# EasyEDA schematic SCH_Sensor-Wind_EasyEDA.json
TITLE: Wind Sensor; REV: 1.0; Date: 2021-08-31; Sheet: 1/1; Drawn By: mromanini; Company: Scott and Marco
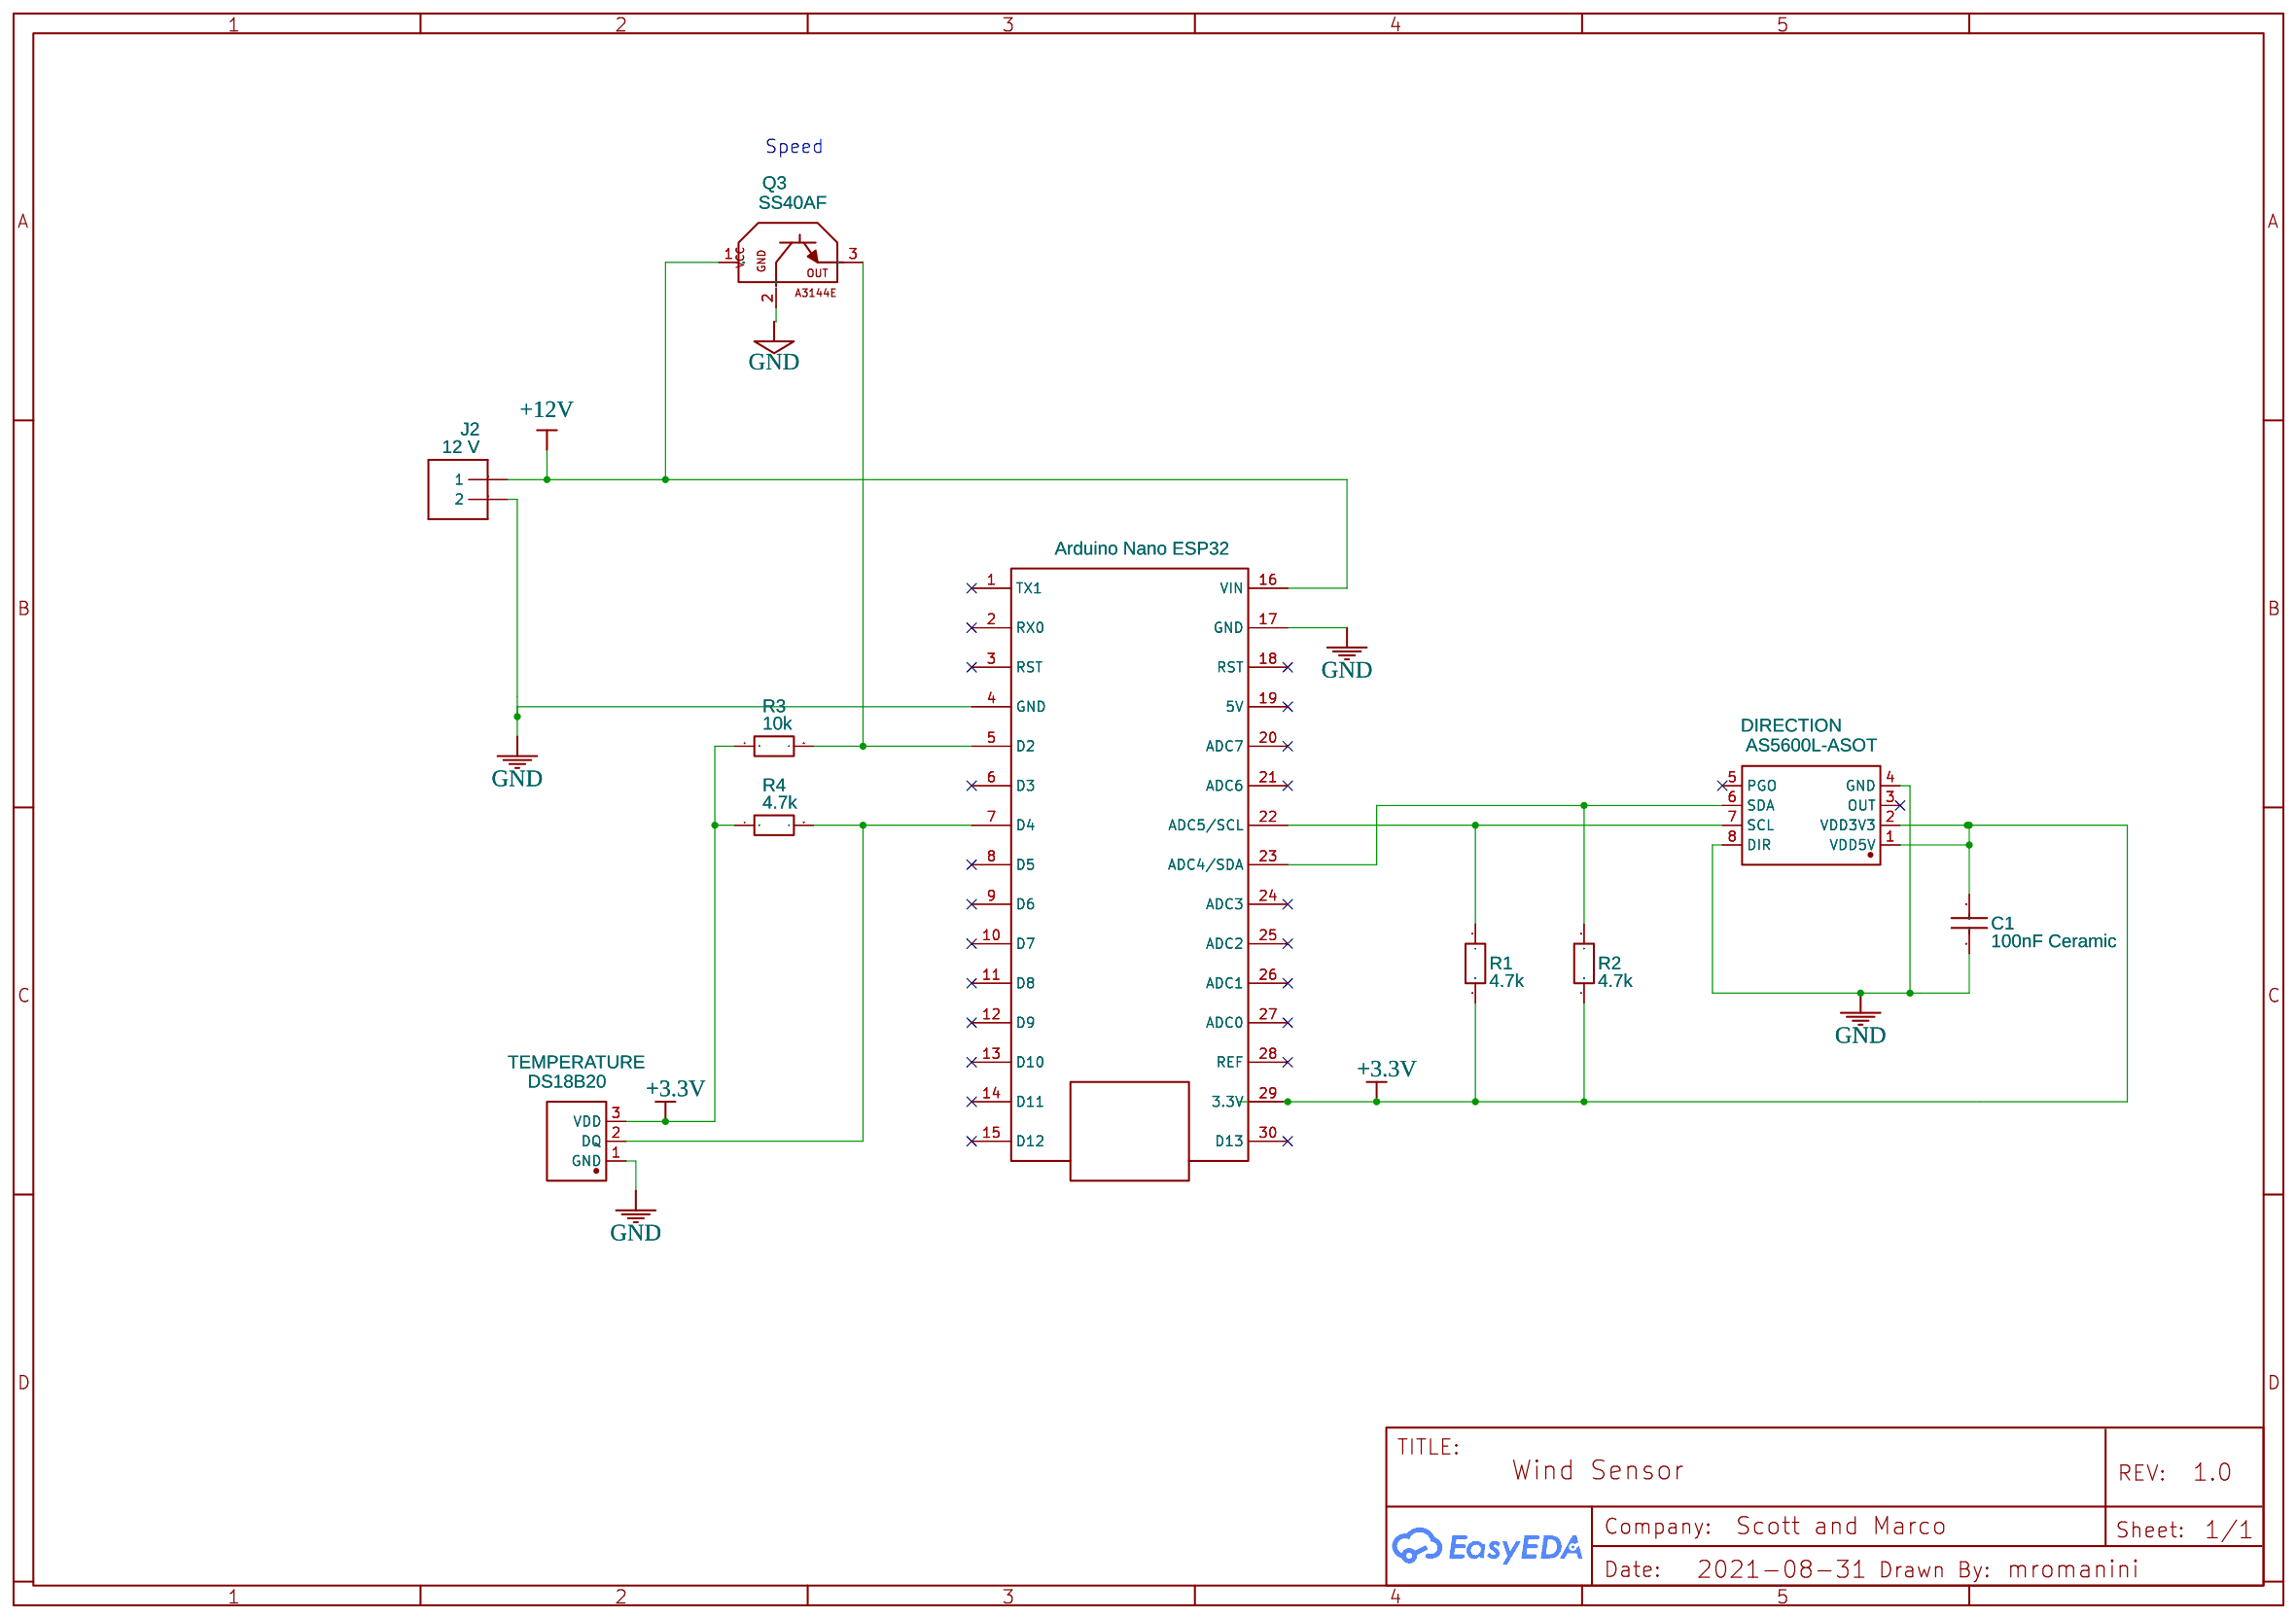
[diagram p0: schematic sheet]

## Parts
C1  100nF Ceramic  [CERAMIC CAPACITOR]
DIRECTION  AS5600L-ASOT  [SOIC-8_L5.0-W4.0-P1.27-LS6.0-BL]
J2  12 V  [1X2-3.5MM]
Q3  SS40AF  [A3144E_HALLSENSOR_COPY]
R1  4.7k  [1K 0.25W]
R2  4.7k  [1K 0.25W]
R3  10k  [1K 0.25W]
R4  4.7k  [1K 0.25W]
TEMPERATURE  DS18B20  [TO-92-3_L4.9-W3.7-P1.27-L]
U1  Arduino Nano ESP32  [ADUINO NANO R3]

## Library data of the parts
C1 = Capacitor_Ceramic: Contributor: huuvinhz755
DIRECTION = AS5600L-ASOM: Supplier: LCSC; Supplier Part: C499458; Manufacturer: 美国AMS; Contributor: LCSC
J2 = TERMBLOCK_1X2-3.5MM: Contributor: Adafruit
Q3 = A3144E_HALLSENSOR_COPY: Manufacturer: Honeywell; Contributor: rakowski.hub; Supplier Part: C778657; Supplier: LCSC
R1-R4 = 1w resistor: Contributor: Kagutsuchi
TEMPERATURE = DS18B20: Supplier: LCSC; Supplier Part: C376006; Manufacturer: Youtai Semiconductor Co., Ltd.; Contributor: LCSC; JLCPCB Part Class: Extended Part
U1 = ARDUINO_NANO_R3: Contributor: Nikolay Yanev

## Nets
+3.3V: C1.1 DIRECTION.1(VDD5V) DIRECTION.2(VDD3V3) R1.1(2) R2.1(2) R3.1(2) R4.1(2) TEMPERATURE.3(VDD) U1.29(3.3V)
+12V: J2.1 Q3.1(Supply) U1.16(VIN)
GND: C1.2 DIRECTION.4(GND) DIRECTION.8(DIR) J2.2 Q3.2(Ground) TEMPERATURE.1(GND) U1.4(GND) U1.17(GND)
Net-(DIRECTION-6): DIRECTION.6(SDA) R2.2(1) U1.23(ADC4/SDA)
Net-(DIRECTION-7): DIRECTION.7(SCL) R1.2(1) U1.22(ADC5/SCL)
Net-(Q3-3): Q3.3(Output) R3.2(1) U1.5(D2)
Net-(R4-2): R4.2(1) TEMPERATURE.2(DQ) U1.7(D4)

Not connected (* = marked no-connect by the designer): DIRECTION 3(OUT)* 5(PGO)*; U1 1(TX1)* 2(RX0)* 3(RST)* 6(D3)* 8(D5)* 9(D6)* 10(D7)* 11(D8)* 12(D9)* 13(D10)* 14(D11)* 15(D12)* 18(RST)* 19(5V)* 20(ADC7)* 21(ADC6)* 24(ADC3)* 25(ADC2)* 26(ADC1)* 27(ADC0)* 28(REF)* 30(D13)*

## Notes on the sheet
- Speed
